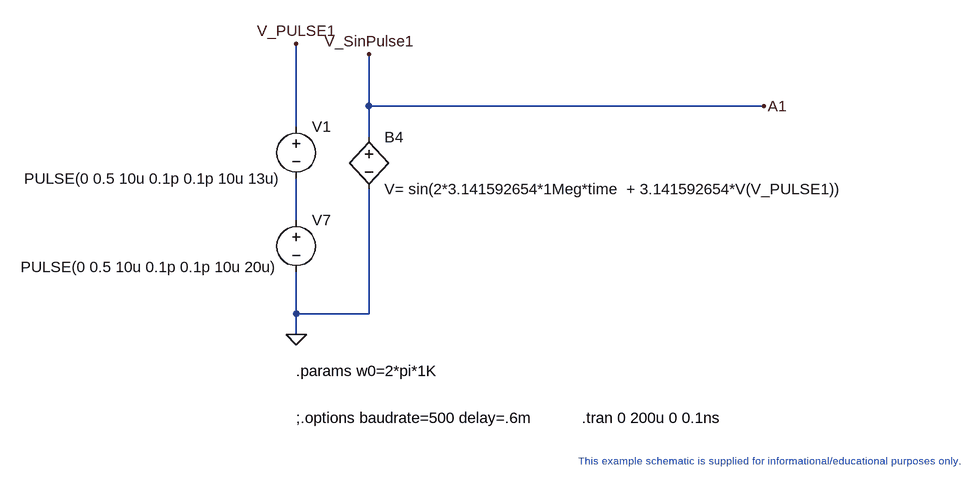
[diagram p0: schematic PLL.asc]
PLL.asc, the LTspice schematic file:
Version 4
SHEET 1 1732 2132
WIRE -1184 1360 -1184 1280
WIRE -576 1360 -1184 1360
WIRE -1296 1392 -1296 1264
WIRE -1184 1408 -1184 1360
WIRE -1296 1536 -1296 1472
WIRE -1296 1680 -1296 1616
WIRE -1184 1680 -1184 1488
WIRE -1184 1680 -1296 1680
WIRE -1296 1712 -1296 1680
FLAG -576 1360 A1
FLAG -1296 1264 V_PULSE1
FLAG -1184 1280 V_SinPulse1
FLAG -1296 1712 0
SYMBOL bv -1184 1392 R0
SYMATTR InstName B4
SYMATTR Value V= sin(2*3.141592654*1Meg*time  + 3.141592654*V(V_PULSE1))
SYMBOL voltage -1296 1520 R0
WINDOW 123 0 0 Left 2
WINDOW 39 0 0 Left 2
WINDOW 3 -424 88 Left 2
SYMATTR Value PULSE(0 0.5 10u 0.1p 0.1p 10u 20u)
SYMATTR InstName V7
SYMBOL voltage -1296 1376 R0
WINDOW 123 0 0 Left 2
WINDOW 39 0 0 Left 2
WINDOW 3 -419 96 Left 2
SYMATTR Value PULSE(0 0.5 10u 0.1p 0.1p 10u 13u)
SYMATTR InstName V1
TEXT -856 1840 Left 2 !.tran 0 200u 0 0.1ns
TEXT -1296 1768 Left 2 !.params w0=2*pi*1K
TEXT -1296 1840 Left 2 !;.options baudrate=500 delay=.6m
TEXT -576 1896 Top 1 ;This example schematic is supplied for informational/educational purposes only.

The netlist it stands for:
* PLL.asc
B4 V_SinPulse1 0 V= sin(2*3.141592654*1Meg*time  + 3.141592654*V(V_PULSE1))
V7 N001 0 PULSE(0 0.5 10u 0.1p 0.1p 10u 20u)
V1 V_PULSE1 N001 PULSE(0 0.5 10u 0.1p 0.1p 10u 13u)
.tran 0 200u 0 0.1ns
.params w0=2*pi*1K
;.options baudrate=500 delay=.6m
* This example schematic is supplied for informational/educational purposes only.
.backanno
.end